# EAGLE design usbkey (EAGLE 7.0.0)
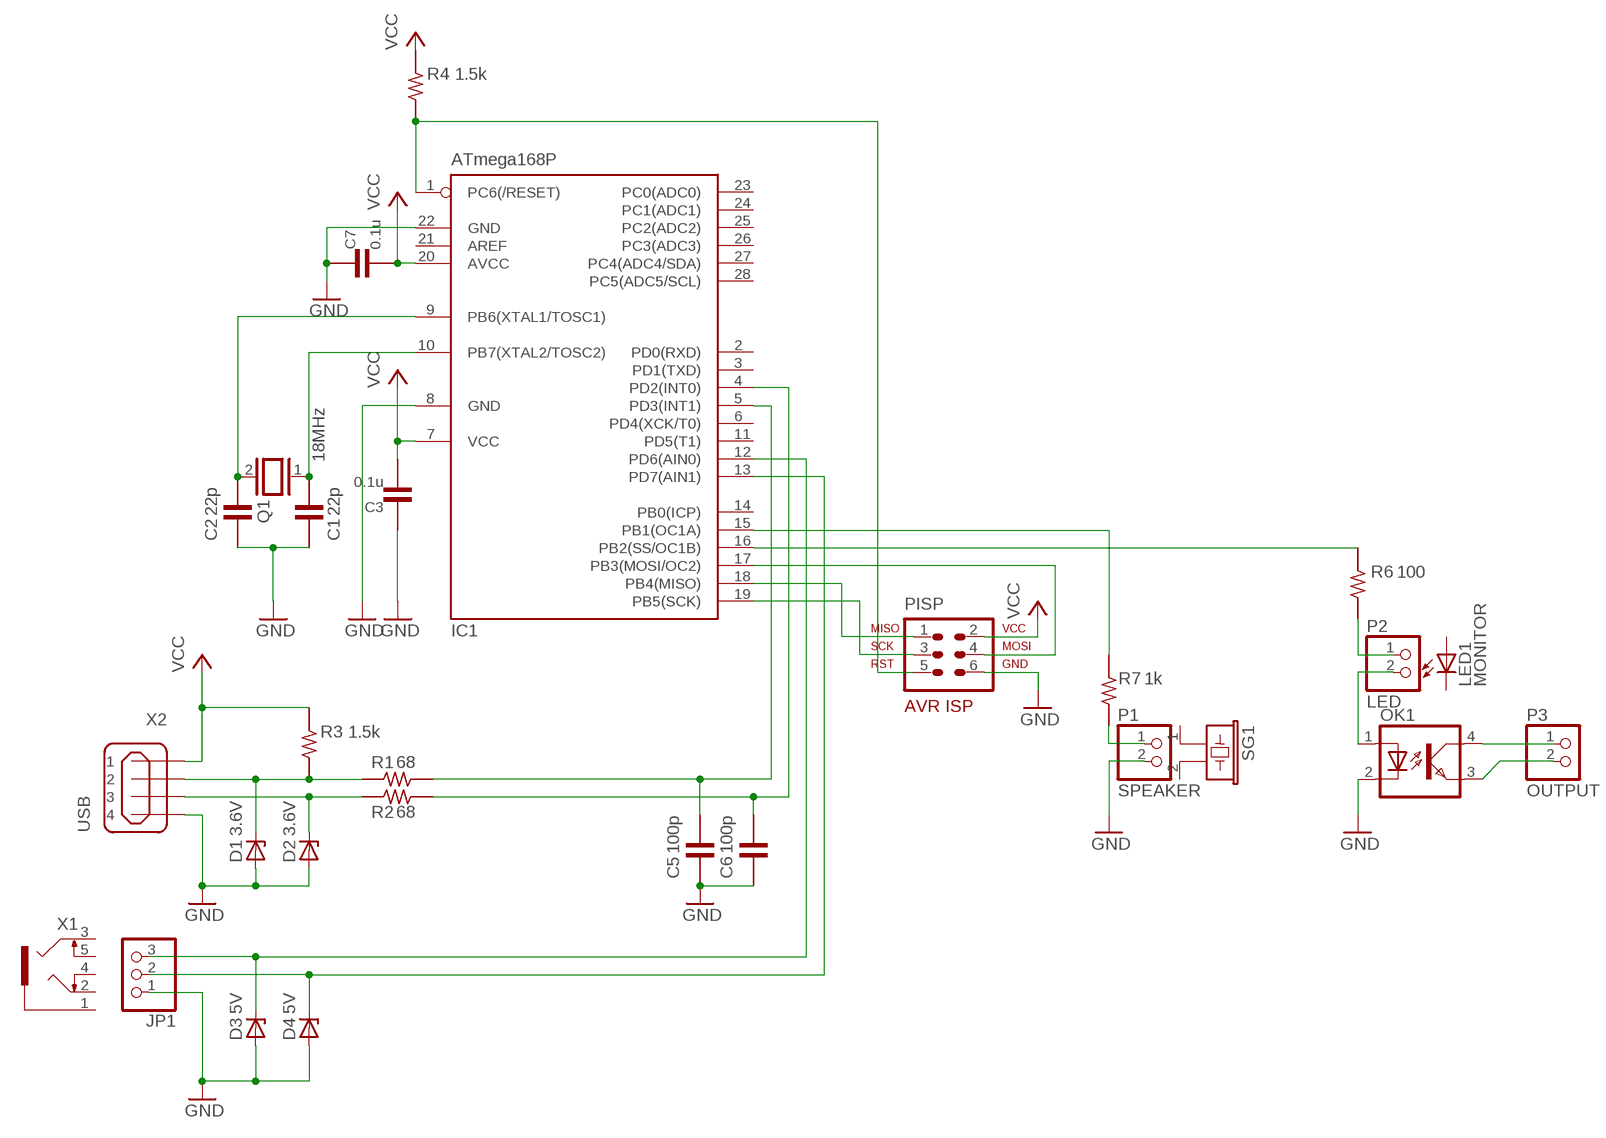
[diagram p0: schematic, sheet 1]

## Parts
C1  22p  C-50V-0302-2.54  [50-0302-2.54]
C2  22p  C-50V-0302-2.54  [50-0302-2.54]
C3  0.1u  C-50V-0302-2.54  [50-0302-2.54]
C5  100p  C-50V-0302-2.54  [50-0302-2.54]
C6  100p  C-50V-0302-2.54  [50-0302-2.54]
C7  0.1u  C-50V-0302-2.54  [50-0302-2.54]
D1  3.6V  BZX55  [DO35Z10]
D2  3.6V  BZX55  [DO35Z10]
D3  5V  BZX55  [DO35Z10]
D4  5V  BZX55  [DO35Z10]
IC1  ATmega168P  MEGA8-P  [DIL28-3]
JP1  PINHD-1X3  [1X03]
LED1  MONITOR  LED3MM  [LED3MM]
OK1  LTV816  [DIL04]
P1  SPEAKER  PINHD-1X2  [1X02]
P2  LED  PINHD-1X2  [1X02]
P3  OUTPUT  PINHD-1X2  [1X02]
PISP  AVR-ISP-6VERT  [AVR-ISP-6]
Q1  18MHz  XTAL/S  [QS]
R1  68  R-1/4W-02.54-V  [1/4W-2.54V]
R2  68  R-1/4W-02.54-V  [1/4W-2.54V]
R3  1.5k  R-1/4W-07.62  [1/4W-7.62H]
R4  1.5k  R-1/4W-02.54-V  [1/4W-2.54V]
R6  100  R-1/4W-07.62  [1/4W-7.62H]
R7  1k  R-1/4W-07.62  [1/4W-7.62H]
SG1  EFBRD22C41  [EFBRD22C41]
X1  1503_09  [1503_09]
X2  USB  MINI-USB_SHIELD4P-85-32004-10X  [85-32004-10X]

## Nets
GND: C1.PAD2 C2.PAD2 C3.PAD1 C5.PAD2 C6.PAD2 C7.PAD1 D1.A D2.A D3.A D4.A IC1.8(GND) IC1.22(GND) JP1.1 OK1.2(C) P1.2 PISP.6 X2.4
N$1: C1.PAD1 IC1.10(PB7(XTAL2/TOSC2)) Q1.1
N$2: C2.PAD1 IC1.9(PB6(XTAL1/TOSC1)) Q1.2
N$3: C5.PAD1 IC1.5(PD3(INT1)) R1.PAD2
N$4: D2.C R2.PAD1 X2.3
N$5: C6.PAD1 IC1.4(PD2(INT0)) R2.PAD2
N$6: D1.C R1.PAD1 R3.PAD1 X2.2
N$7: D3.C IC1.12(PD6(AIN0)) JP1.3
N$8: D4.C IC1.13(PD7(AIN1)) JP1.2
N$9: IC1.1(PC6(/RESET)) PISP.5 R4.PAD1
N$10: IC1.17(PB3(MOSI/OC2)) PISP.4
N$11: IC1.19(PB5(SCK)) PISP.3
N$12: IC1.18(PB4(MISO)) PISP.1
N$13: P2.1 R6.PAD1
N$14: P1.1 R7.PAD1
N$15: IC1.15(PB1(OC1A)) R7.PAD2
N$16: IC1.16(PB2(SS/OC1B)) R6.PAD2
N$17: OK1.1(A) P2.2
OUT+: OK1.4(COL) P3.1
OUT-: OK1.3(EMIT) P3.2
VCC: C3.PAD2 C7.PAD2 IC1.7(VCC) IC1.20(AVCC) PISP.2 R3.PAD2 R4.PAD2 X2.1
Unconnected: IC1.2(PD0(RXD)) IC1.3(PD1(TXD)) IC1.6(PD4(XCK/T0)) IC1.11(PD5(T1)) IC1.14(PB0(ICP)) IC1.21(AREF) IC1.23(PC0(ADC0)) IC1.24(PC1(ADC1)) IC1.25(PC2(ADC2)) IC1.26(PC3(ADC3)) IC1.27(PC4(ADC4/SDA)) IC1.28(PC5(ADC5/SCL)) LED1.A LED1.K(C) SG1.1 SG1.2 X1.1 X1.2 X1.3 X1.4 X1.5 X2.M1(S1) X2.M2(S2)

## Library data of the parts
C1-C3 C5-C7 = c-j:C-: CAPACITOR Japanese symbol
D1-D4 = diode:BZX55: Z DIODE
IC1 = atmel:MEGA8-P: MICROCONTROLLER 8 Kbytes FLASH, 1 kbytes SRAM, 512 bytes EEPROM, USART, 4-channel 10 bit ADC, 2-channel 8 bit ADC Pin compatible with Atmega48, ATMega88, ATMega168 Source: avr.lbr; OC_FARNELL: unknown; OC_NEWARK: unknown
JP1 = pinhead:PINHD-1X3: PIN HEADER
LED1 = led:LED: LED OSRAM: - CHIPLED LG R971, LG N971, LY N971, LG Q971, LY Q971, LO R971, LY R971 LH N974, LH R974 LS Q976, LO Q976, LY Q976 LO Q996 - Hyper CHIPLED LW Q18S LB Q993, LB Q99A, LB R99A - SideLED LS A670, LO A670, LY A670, LG A670, LP A670 LB A673, LV A673, LT A673, LW A673 LH A674 LY A675 LS A676, LA A676, LO A676, LY A676, LW A676 LS A679, LY A679, LG A679 - Hyper Micro SIDELED® LS Y876, LA Y876, LO Y876, LY Y876 LT Y87S - SmartLED LW L88C, LW L88S LB L89C, LB L89S, LG L890 LS L89K, LO L89K, LY L89K LS L896, LA L896, LO L896, LY L896 - TOPLED LS T670, LO T670, LY T670, LG T670, LP T670 LSG T670, LSP T670, LSY T670, LOP T670, LYG T670 LG T671, LOG T671, LSG T671 LB T673, LV T673, LT T673, LW T673 LH T674 LS T676, LA T676, LO T676, LY T676, LB T676, LH T676, LSB T676, LW T676 LB T67C, LV T67C, LT T67C, LS T67K, LO T67K, LY T67K, LW E67C LS E67B, LA E67B, LO E67B, LY E67B, LB E67C, LV E67C, LT E67C LW T67C LS T679, LY T679, LG T679 LS T770, LO T770, LY T770, LG T770, LP T770 LB T773, LV T773, LT T773, LW T773 LH T774 LS E675, LA E675, LY E675, LS T675 LS T776, LA T776, LO T776, LY T776, LB T776 LHGB T686 LT T68C, LB T68C - Hyper Mini TOPLED® LB M676 - Mini TOPLED Santana® LG M470 LS M47K, LO M47K, LY M47K Source: http://www.osram.convergy.de LUXEON: - LUMILED® LXK2-PW12-R00, LXK2-PW12-S00, LXK2-PW14-U00, LXK2-PW14-V00 LXK2-PM12-R00, LXK2-PM12-S00, LXK2-PM14-U00 LXK2-PE12-Q00, LXK2-PE12-R00, LXK2-PE12-S00, LXK2-PE14-T00, LXK2-PE14-U00 LXK2-PB12-K00, LXK2-PB12-L00, LXK2-PB12-M00, LXK2-PB14-N00, LXK2-PB14-P00, LXK2-PB14-Q00 LXK2-PR12-L00, LXK2-PR12-M00, LXK2-PR14-Q00, LXK2-PR14-R00 LXK2-PD12-Q00, LXK2-PD12-R00, LXK2-PD12-S00 LXK2-PH12-R00, LXK2-PH12-S00 LXK2-PL12-P00, LXK2-PL12-Q00, LXK2-PL12-R00 Source: www.luxeon.com KINGBRIGHT: KA-3528ASYC Source: www.kingbright.com
OK1 = optocoupler:LTV816: OPTO COUPLER Source: LITEON, LTV816.pdf; OC_FARNELL: unknown; OC_NEWARK: unknown
P1-P3 = pinhead:PINHD-1X2: PIN HEADER
PISP = avr-7:AVR-ISP-6: AVR ISP-6 Serial Programming Header
Q1 = special:XTAL/S: CRYSTAL
R1-R4 R6 R7 = r-j:R-: RESISTOR Japanese symbol
SG1 = buzzer:EFB?: Piezoelectric Acoustic Transducer Source: Panbasonic .. 2SC1685.pdf; OC_FARNELL: unknown; OC_NEWARK: unknown
X1 = con-lumberg:1503_09: Jack connectors according to JISC 6560, 3.5 mm Klinkeneinbaukupplung nach JISC 6560, 3,5 mm, 3-polig/ stereo, abgewinkelte Ausführung, mit 2 Öffnern und Lötaugen, für Leiterplatten Rückseitenmontage Source: http://www.lumberg.com/Produkte/PDFs/1503_09.pdf; OC_FARNELL: 1243244; OC_NEWARK: unknown
X2 = con-cypressindustries:MINI-USB_SHIELD4P-: MINI USB 4 Pol. Source: www.cypressindustries.com; OC_FARNELL: unknown; OC_NEWARK: unknown

## Board
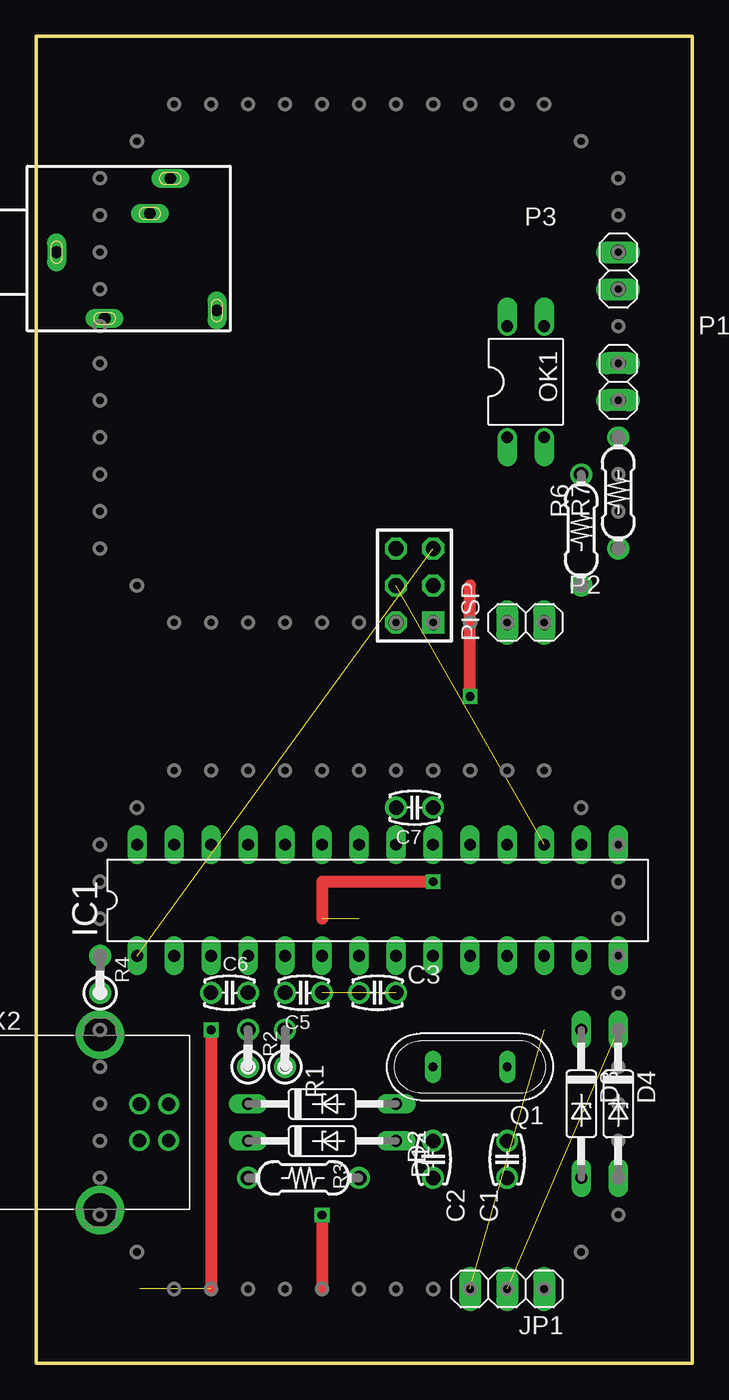
[diagram p1: board, top side]
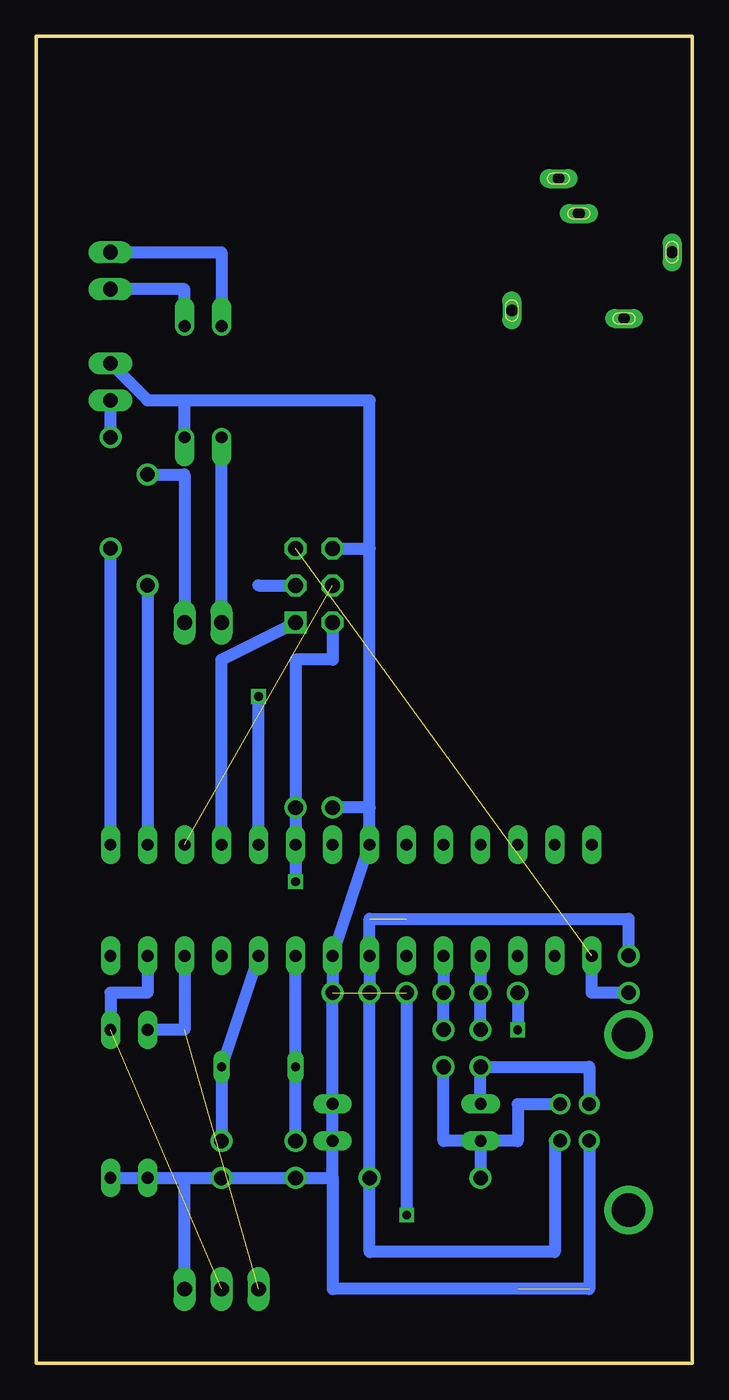
[diagram p2: board, bottom side, seen from below]

Size 45 x 91 mm. Coordinates in mm from the lower left corner, seen from the top.
Outline: 45,0 45,91 0,91 0,0 45,0
Copper layers (1*16): Top 0.035mm / dielectric 1.5mm / Bottom 0.035mm
Design rules "default *": minimum track width 10mil, minimum drill 24mil, track to track 8mil, track to pad 8mil, pad to pad 8mil, via to via 8mil, smd to smd 8mil, copper to edge 40mil, drill to drill 8mil, minimum pad ring 10mil, minimum via ring 8mil, stop-mask expansion 4mil, vias tented up to drill 0mil, thermal gap 10mil

### Footprints (pad centres in the part's own frame; a part is rotated, then mirrored left to right if it is on the bottom)
50-0302-2.54 = drill 1: PAD1 -1.27,0; PAD2 1.27,0
DO35Z10 = drill 0.813 long: A 5.08,0; C -5.08,0
DIL28-3 = drill 0.813 long: 1 -16.51,-3.81; 2 -13.97,-3.81; 3 -11.43,-3.81; 4 -8.89,-3.81; 5 -6.35,-3.81; 6 -3.81,-3.81; 7 -1.27,-3.81; 8 1.27,-3.81; 9 3.81,-3.81; 10 6.35,-3.81; 11 8.89,-3.81; 12 11.43,-3.81; 13 13.97,-3.81; 14 16.51,-3.81; 15 16.51,3.81; 16 13.97,3.81; 17 11.43,3.81; 18 8.89,3.81; 19 6.35,3.81; 20 3.81,3.81; 21 1.27,3.81; 22 -1.27,3.81; 23 -3.81,3.81; 24 -6.35,3.81; 25 -8.89,3.81; 26 -11.43,3.81; 27 -13.97,3.81; 28 -16.51,3.81
1X03 = drill 1.016 long: 1 -2.54,0; 2 0,0; 3 2.54,0
LED3MM = drill 0.813 octagon: A -1.27,0; K 1.27,0
DIL04 = drill 0.813 offset: 1 -1.27,-3.81; 2 1.27,-3.81; 3 1.27,3.81; 4 -1.27,3.81
1X02 = drill 1.016 long: 1 -1.27,0; 2 1.27,0
AVR-ISP-6 = drill 1.016 square: 1 -2.54,-1.27 | drill 1.016 octagon: 2 -2.54,1.27; 3 0,-1.27; 4 0,1.27; 5 2.54,-1.27; 6 2.54,1.27
QS = drill 0.61 long: 1 -2.54,0; 2 2.54,0
1/4W-2.54V = drill 1: PAD1 0,0; PAD2 2.54,0
1/4W-7.62H = drill 1: PAD1 -3.81,0; PAD2 3.81,0
EFBRD22C41 = drill 1.1 pad 1.676: 1 -5,0; 2 5,0
1503_09 = drill 0.8 pad 1.2 long: 1 0,-2.1; 2 -4.55,-5.4; 3 5.05,-9.9; 4 -4,-13.1; 5 2.65,-8.5
85-32004-10X = drill 0.92 pad 1.27: 1 4.71,-1.25; 2 4.71,1.25; 3 2.71,1.25; 4 2.71,-1.25 | drill 2.3 pad 3: M1 0,6.02; M2 0,-6.02

### Placement (x,y rotation side)
C1  32.3,13.97 270 top
C2  27.22,13.97 270 top
C3  23.41,25.4 180 top
C5  18.33,25.4 0 top
C6  13.25,25.4 180 top
C7  25.95,38.1 0 top
D1  19.6,15.24 0 top
D2  19.6,17.78 0 top
D3  37.38,17.78 270 top
D4  39.92,17.78 270 top
IC1  23.41,31.75 0 top
JP1  32.3,5.08 180 top
LED1  83.1,19.05 90 top  (outside the outline)
OK1  33.57,67.31 0 top
P1  39.92,67.31 90 top
P2  33.57,50.8 180 top
P3  39.92,74.93 270 top
PISP  25.95,53.34 90 top
Q1  29.76,20.32 180 top
R1  17.06,20.32 90 top
R2  14.52,20.32 90 top
R3  18.33,12.7 0 top
R4  4.36,25.4 90 top
R6  37.38,57.15 270 top
R7  39.92,59.69 270 top
SG1  60.24,15.24 270 top  (outside the outline)
X1  -0.72,76.2 90 top
X2  4.36,16.51 0 top

### Tracks (layer width: path | path; a pad name or v marks a point on that pad's centre or on a via)
GND  (via drill 0.6)  (2 unrouted)
  Top 0.813: v19.6,10.16 19.6,5.08 | v11.98,22.86 11.98,5.08
  Bottom 0.813: X2.4 7.07,5.08 24.68,5.08 24.68,12.7 | 24.68,12.7 D1.A D2.A C3.PAD1 IC1.8 IC1.22 22.14,38.1 | 24.68,12.7 C2.PAD2 C1.PAD2 34.84,12.7 | 34.84,12.7 D3.A D4.A | JP1.1 34.84,12.7 | C5.PAD2 v19.6,10.16 | C6.PAD2 v11.98,22.86 | 22.14,38.1 C7.PAD1 | 22.14,38.1 22.14,55.88 | 22.14,55.88 22.14,66.04 34.84,66.04 | OK1.2 34.84,66.04 | P1.2 37.38,66.04 34.84,66.04 | PISP.6 22.14,55.88
N$1
  Bottom 0.813: IC1.10 Q1.1 C1.PAD1
N$2
  Bottom 0.813: C2.PAD1 Q1.2 IC1.9
N$3
  Bottom 0.813: IC1.5 C5.PAD1 R1.PAD2
N$4
  Bottom 0.813: X2.3 7.07,20.32 R2.PAD1 D2.C
N$5
  Bottom 0.813: IC1.4 C6.PAD1 R2.PAD2
N$6
  Bottom 0.813: D1.C 17.06,15.24 R1.PAD1 | D1.C R3.PAD1 | X2.2 11.98,17.76 11.98,15.24 D1.C
N$7  (1 unrouted)
  Bottom 0.813: IC1.12 34.84,22.86 D3.C
N$8  (1 unrouted)
  Bottom 0.813: IC1.13 37.38,25.4 39.92,25.4 D4.C
N$9  (1 unrouted)
  Bottom 0.813: R4.PAD1 6.9,25.4 IC1.1
N$10  (1 unrouted)
N$11  (via drill 0.6)  (1 unrouted)
  Top 0.813: v29.76,45.72 29.76,53.34
  Bottom 0.813: 29.76,53.34 PISP.3 | IC1.19 v29.76,45.72
N$12
  Bottom 0.813: IC1.18 32.3,48.26 PISP.1
N$13
  Bottom 0.813: R6.PAD1 34.84,60.96 P2.1
N$14
  Bottom 0.813: R7.PAD1 P1.1
N$15
  Bottom 0.813: IC1.15 R7.PAD2
N$16
  Bottom 0.813: R6.PAD2 IC1.16
N$17
  Bottom 0.813: P2.2 OK1.1
OUT+
  Bottom 0.813: P3.1 32.3,76.2 OK1.4
OUT-
  Bottom 0.813: OK1.3 34.84,73.66 P3.2
VCC  (via drill 0.6)  (1 unrouted)
  Top 0.813: v27.22,33.02 19.6,33.02 19.6,30.48
  Bottom 0.813: X2.1 9.44,15.26 9.44,7.62 22.14,7.62 R3.PAD2 C3.PAD2 IC1.7 22.14,30.48 4.36,30.48 R4.PAD2 | v27.22,33.02 IC1.20 C7.PAD2 27.22,48.26 24.68,48.26 PISP.2